# EAGLE design Preamp (EAGLE 9.2.2)
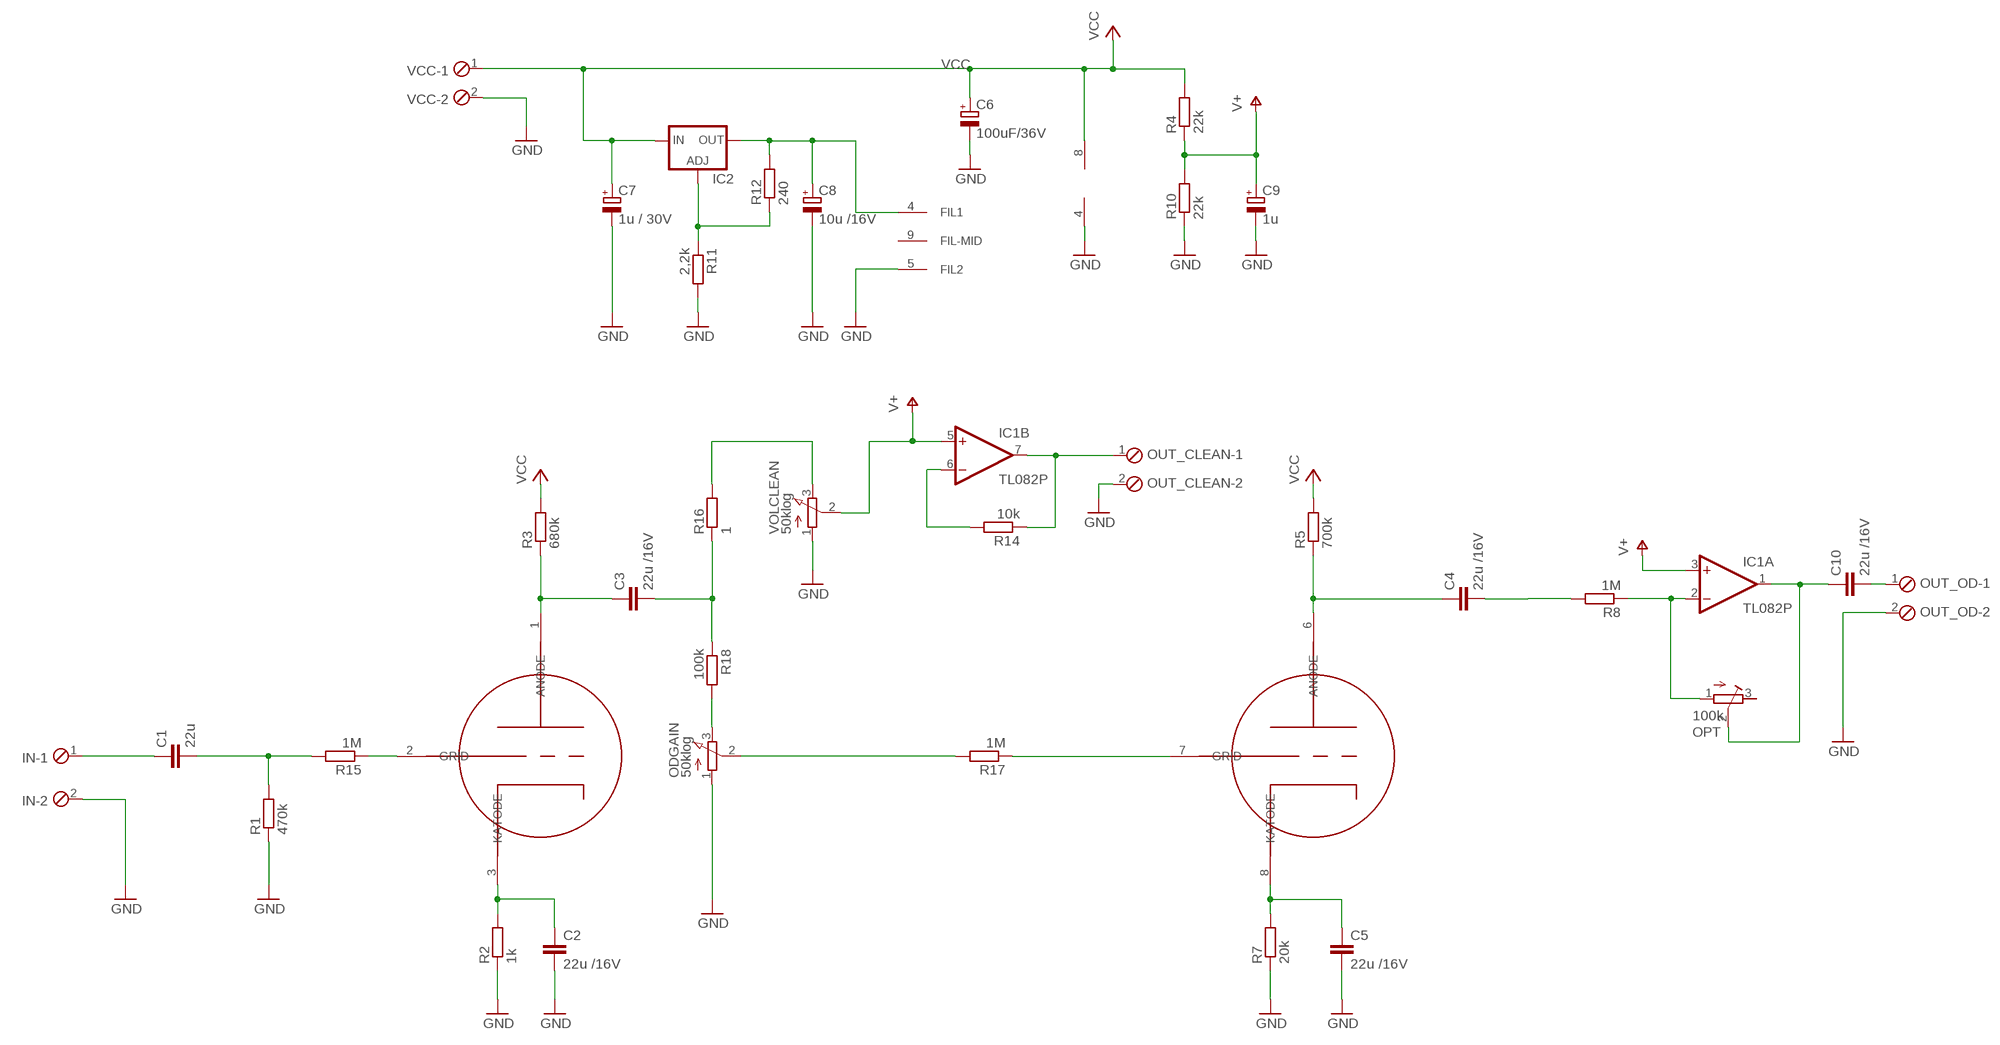
[diagram p0: schematic, sheet 1]

## Parts
C1  22u  C-EU050-030X075  [C050-030X075]
C2  22u /16V  C-EU050-030X075  [C050-030X075]
C3  22u /16V  C-EU050-030X075  [C050-030X075]
C4  22u /16V  C-EU050-030X075  [C050-030X075]
C5  22u /16V  C-EU050-030X075  [C050-030X075]
C6  100uF/36V  CPOL-EUE2.5-5  [E2,5-5]
C7  1u / 30V  CPOL-EUE2.5-5  [E2,5-5]
C8  10u /16V  CPOL-EUE2.5-5  [E2,5-5]
C9  1u  CPOL-EUE2.5-5  [E2,5-5]
C10  22u /16V  C-EU050-030X075  [C050-030X075]
IC1  TL082P  [DIL08]
IC2  LM317TS  [317TS]
IN  MPT2  [2POL254]
ODGAIN  50klog  3RP/1610N  [3RP/1610N]
OPT  100k  R-TRIMM74W  [RTRIM74W]
OUT_CLEAN  MPT2  [2POL254]
OUT_OD  MPT2  [2POL254]
R1  470k  R-EU_0207/12  [0207/12]
R2  1k  R-EU_0207/12  [0207/12]
R3  680k  R-EU_0207/12  [0207/12]
R4  22k  R-EU_0207/12  [0207/12]
R5  700k  R-EU_0207/12  [0207/12]
R7  20k  R-EU_0207/10  [0207/10]
R8  1M  R-EU_0207/12  [0207/12]
R10  22k  R-EU_0207/12  [0207/12]
R11  2,2k  R-EU_0207/12  [0207/12]
R12  240  R-EU_0207/12  [0207/12]
R14  10k  R-EU_0204/7  [0204/7]
R15  1M  R-EU_0207/12  [0207/12]
R16  1  R-EU_0207/12  [0207/12]
R17  1M  R-EU_0207/12  [0207/12]
R18  100k  R-EU_0207/12  [0207/12]
U$1  12AX7  [12AX7]
VCC  MPT2  [2POL254]
VOLCLEAN  50klog  3RP/1610N  [3RP/1610N]

## Nets
GND: C2.2 C5.2 C6.- C7.- C8.- C9.- IC1.4(P:V-) IN.2 ODGAIN.1(A) OUT_CLEAN.2 OUT_OD.2 R1.1 R2.1 R7.1 R10.1 R11.2 U$1.5(FIL2) VCC.2 VOLCLEAN.1(A)
N$1: C1.2 R1.2 R15.2
N$2: C2.1 R2.2 U$1.3(KATODE)
N$3: C5.1 R7.2 U$1.8(KATODE)
N$5: C3.1 R3.1 U$1.1(ANODE)
N$6: C3.2 R16.1 R18.1
N$7: C4.1 R5.1 U$1.6(ANODE)
N$8: C4.2 R8.2
N$9: C1.1 IN.1
N$10: IC1.2(A:-IN) OPT.1(A) R8.1
N$11: ODGAIN.2(S) R17.2
N$12: C10.1 IC1.1(A:OUT) OPT.2(S)
N$13: IC1.7(B:OUT) OUT_CLEAN.1 R14.1
N$14: C8.+ IC2.2(OUT) R12.2 U$1.4(FIL1)
N$15: R15.1 U$1.2(GRID)
N$16: IC2.1(ADJ) R11.1 R12.1
N$17: IC1.6(B:-IN) R14.2
N$18: R17.1 U$1.7(GRID)
N$19: R16.2 VOLCLEAN.3(E)
N$20: ODGAIN.3(E) R18.2
N$21: C10.2 OUT_OD.1
V+: C9.+ IC1.3(A:+IN) IC1.5(B:+IN) R4.1 R10.2 VOLCLEAN.2(S)
VCC: C6.+ C7.+ IC1.8(P:V+) IC2.3(IN) R3.2 R4.2 R5.2 VCC.1
Unconnected: OPT.3(E) U$1.9(FIL-MID)

## Library data of the parts
C1-C5 C10 = rcl:C-EU: CAPACITOR, European symbol; SPICEPREFIX: C
C6-C9 = rcl:CPOL-EU: POLARIZED CAPACITOR, European symbol; SPICEPREFIX: C
IC1 = linear:TL082: OP AMP Data sheet <http://www.ti.com/lit/ds/symlink/tl084a . pdf>; DATA_SHEET: <a href="http://www.ti.com/lit/ds/symlink/tl084a.pdf"> Data sheet </a>
IC2 = v-reg:LM317TS: VOLTAGE REGULATOR
IN OUT_CLEAN OUT_OD VCC = con-phoenix-254:MPT2: PHOENIX CONNECTOR; OC_FARNELL: unknown; OC_NEWARK: unknown
ODGAIN VOLCLEAN = pot:3RP/1610N: 16mm Potentiometer one level Source: http://www.alphapotentiometers.net/html/16mm_pot_2.html
OPT = rcl:R-TRIMM: Trimm resistor; SPICEMODEL: X; SPICEPREFIXL: POT
R1-R5 R7 R8 R10-R12 R14-R18 = rcl:R-EU_: RESISTOR, European symbol; SPICEPREFIX: R
U$1 = 12ax7:12AX7

## Board
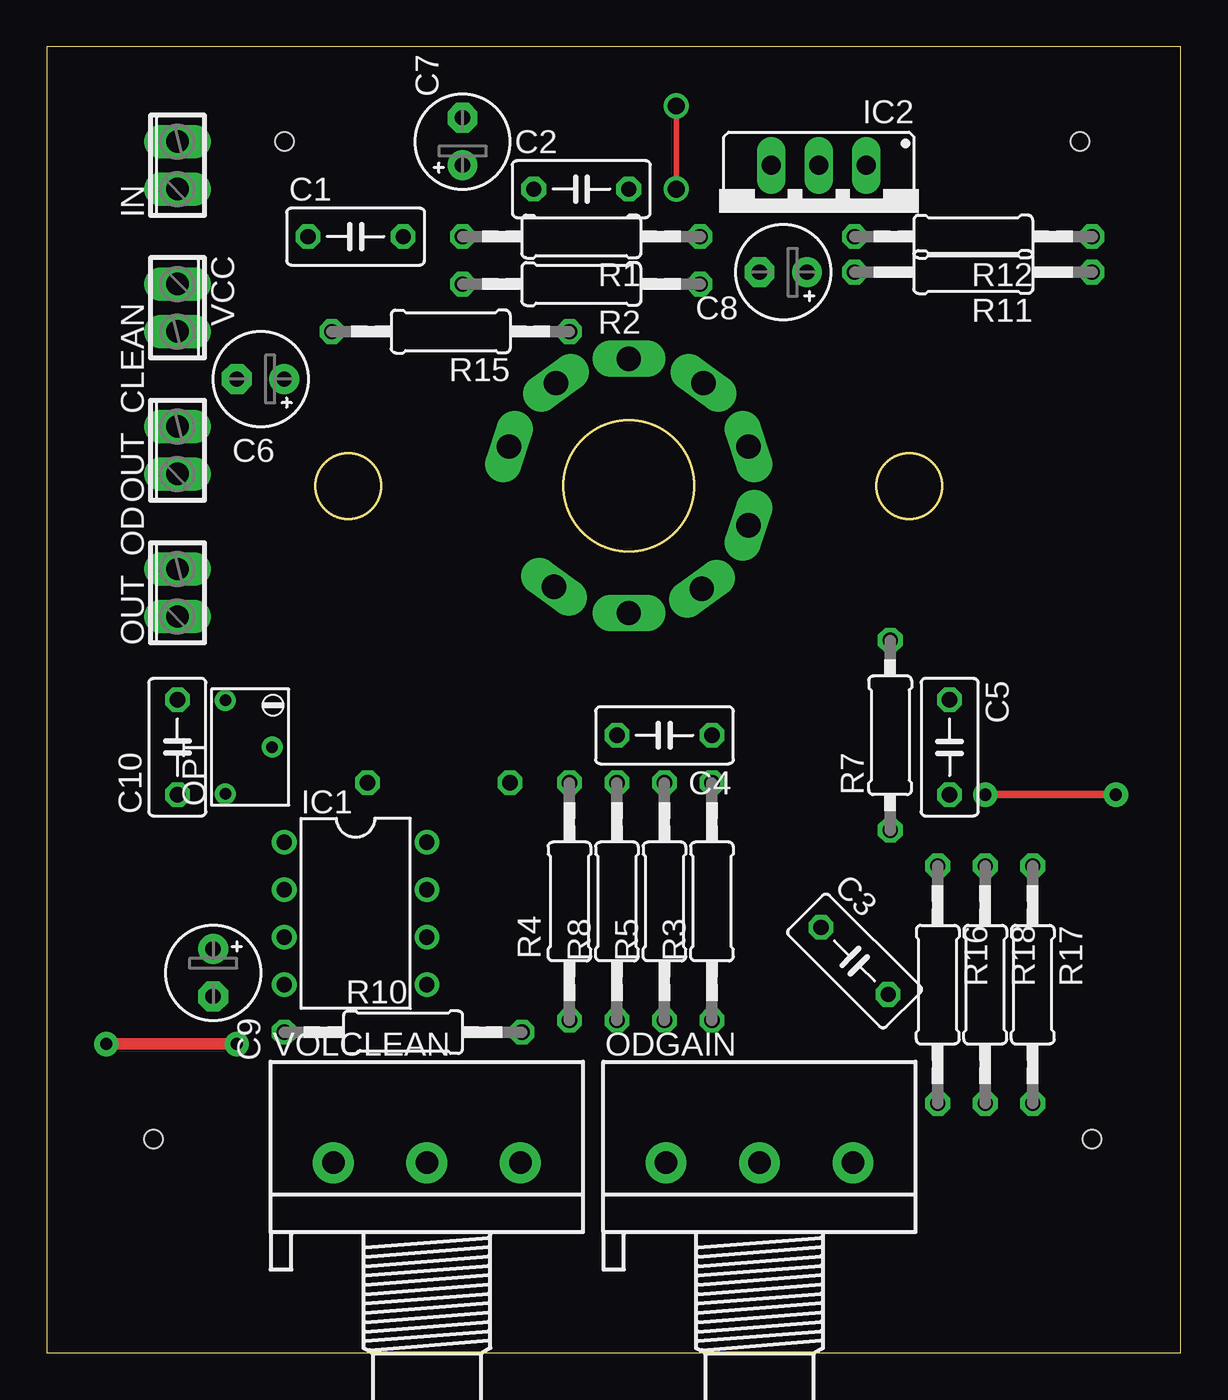
[diagram p1: board, top side]
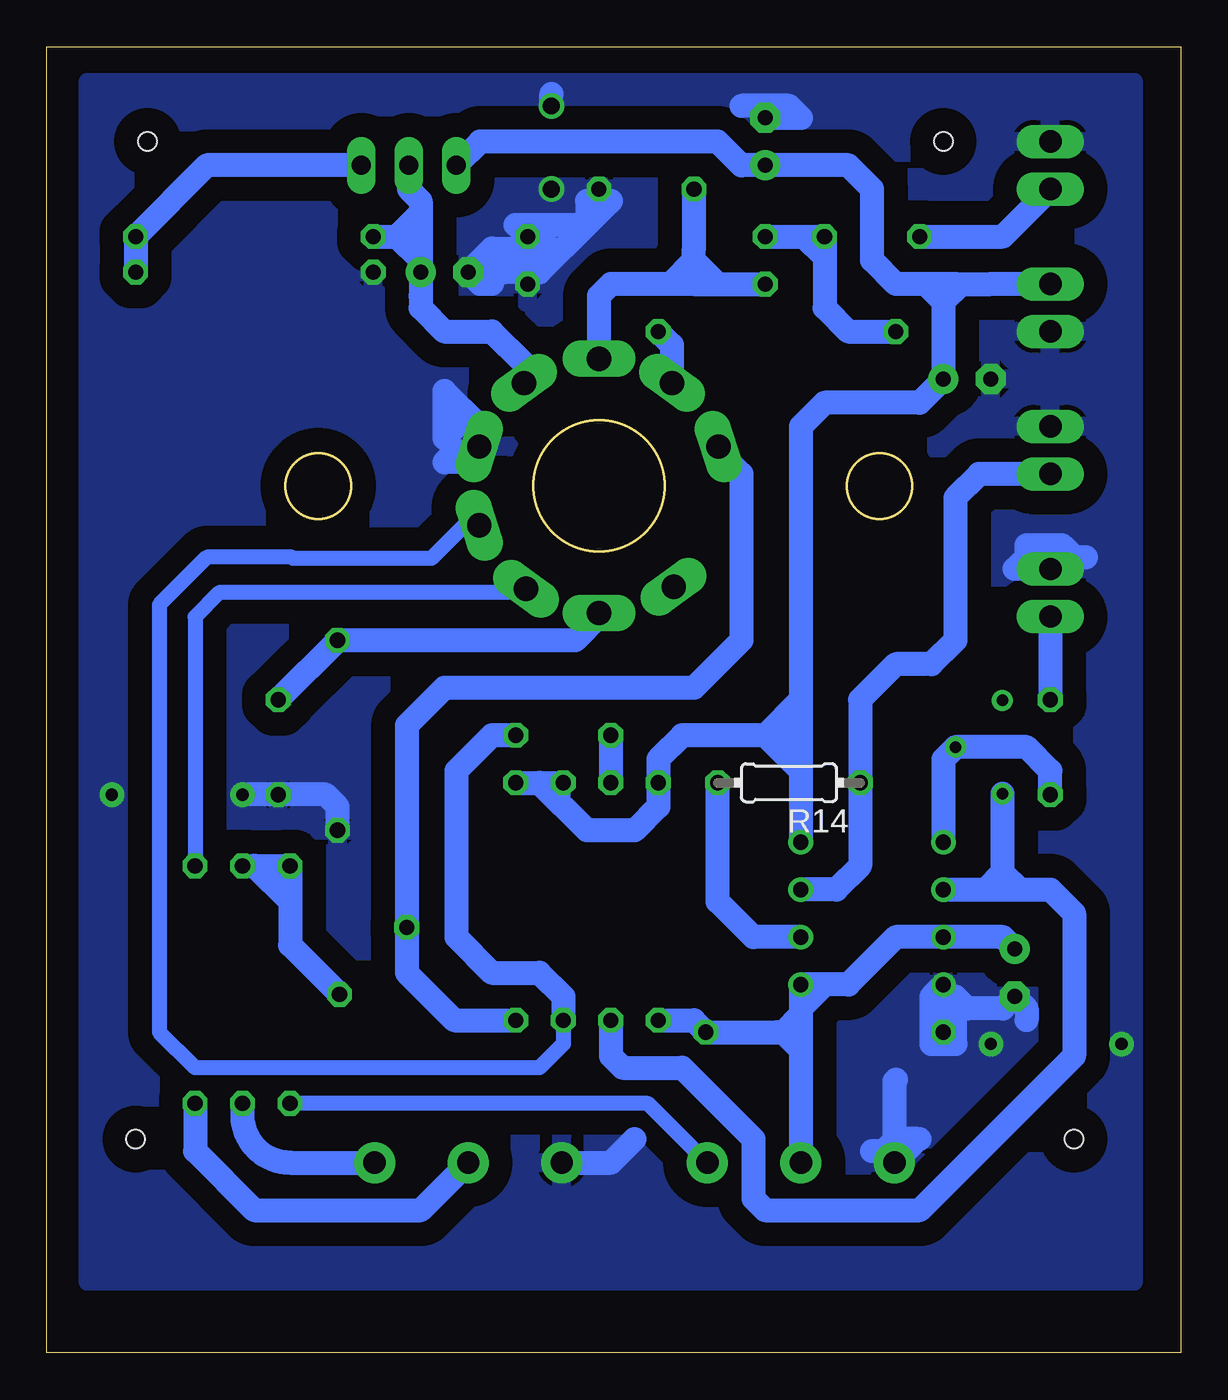
[diagram p2: board, bottom side, seen from below]

Size 60.63 x 69.84 mm. Coordinates in mm from the lower left corner, seen from the top.
Outline: 0,0 60.63,0 60.63,69.84 0,69.84 0,0
Copper layers (1*16): Top 0.035mm / dielectric 1.5mm / Bottom 0.035mm
Design rules "default": minimum track width 6mil, minimum drill 0.35mm, track to track 6mil, track to pad 6mil, pad to pad 6mil, via to via 6mil, smd to smd 6mil, copper to edge 40mil, drill to drill 6mil, minimum pad ring 10mil, minimum via ring 8mil, stop-mask expansion 4mil, vias tented up to drill 0mil, thermal gap 10mil
Holes 1 mm at 5.71,11.43 55.88,11.43 55.24,64.77 12.7,64.77

### Footprints (pad centres in the part's own frame; a part is rotated, then mirrored left to right if it is on the bottom)
C050-030X075 = drill 0.813 octagon: 1 -2.54,0; 2 2.54,0
E2,5-5 = drill 0.813 pad 1.6: + -1.27,0 | drill 0.813 pad 1.6 octagon: - 1.27,0
DIL08 = drill 0.813 pad 1.27: 1 -3.81,-3.81; 2 -1.27,-3.81; 3 1.27,-3.81; 4 3.81,-3.81; 5 3.81,3.81; 6 1.27,3.81; 7 -1.27,3.81; 8 -3.81,3.81
317TS = drill 1.016 long: 1 -2.54,-2.54; 2 0,-2.54; 3 2.54,-2.54
2POL254 = drill 1.2 long: 1 -1.27,0; 2 1.27,0
3RP/1610N = drill 1.2 pad 2.184: 1 -5,0; 2 0,0; 3 5,0
RTRIM74W = drill 0.61: 1 -1.25,-2.5; 2 1.25,0; 3 -1.25,2.5
0207/12 = drill 0.813 octagon: 1 -6.35,0; 2 6.35,0
0207/10 = drill 0.813 octagon: 1 -5.08,0; 2 5.08,0
0204/7 = drill 0.813 octagon: 1 -3.81,0; 2 3.81,0
12AX7 = drill 1.3 long: 1 -6.4,2.1; 2 -3.9,5.5; 3 0,6.8; 4 4,5.5; 5 6.4,2.1; 6 6.4,-2.1; 7 3.9,-5.5; 8 0,-6.8; 9 -4,-5.4

### Placement (x,y rotation side)
C1  16.51,59.69 0 top
C2  28.57,62.23 0 top
C3  43.18,20.95 315 top
C4  33.02,33.02 180 top
C5  48.26,32.38 270 top
C6  11.43,52.07 180 top
C7  22.23,64.77 90 top
C8  39.37,57.78 180 top
C9  8.89,20.32 270 top
C10  6.98,32.38 90 top
IC1  16.51,23.49 270 top
IC2  41.27,60.96 180 top
IN  6.98,63.5 90 top
ODGAIN  38.1,10.16 0 top
OPT  10.79,32.38 0 top
OUT_CLEAN  6.98,48.26 90 top
OUT_OD  6.98,40.64 90 top
R1  28.57,59.69 180 top
R2  28.57,57.15 180 top
R3  35.56,24.13 90 top
R4  27.94,24.13 90 top
R5  33.02,24.13 90 top
R7  45.09,33.02 90 top
R8  30.48,24.13 90 top
R10  19.05,17.14 0 top
R11  49.53,57.78 180 top
R12  49.53,59.69 180 top
R14  20.95,30.48 180 bottom
R15  21.59,54.61 180 top
R16  47.62,19.69 270 top
R17  52.7,19.69 270 top
R18  50.16,19.69 270 top
U$1  31.11,46.35 0 top
VCC  6.98,55.88 270 top
VOLCLEAN  20.32,10.16 0 top

### Tracks (layer width: path | path; a pad name or v marks a point on that pad's centre or on a via)
GND  (via drill 0.65 pad 1.3, 0.9, 0.9 pad 1.3)
  Top 0.305: v33.65,66.67 v33.65,62.23
  Top 0.406: v50.16,29.84 v57.15,29.84
  Top 0.61: v3.17,16.51 v10.16,16.51
  Bottom 1.27: v33.65,66.67 33.65,67.31 | ODGAIN.1 30.48,10.16 29.21,11.43 | 15.24,14.61 15.32,14.53 VOLCLEAN.1 | R7.1 45.09,29.21 45.72,29.84 C5.2 v50.16,29.84 | 38.73,49.53 39.37,48.89 39.37,51.43 37.52,49.58 U$1.5 38.34,47.62 39.37,47.62 38.73,48.26 | 33.65,59.05 36.83,59.05 C8.- 37.46,57.15 36.83,57.15 36.83,58.42 36.2,57.78 34.29,57.78 31.75,60.32 | R1.1 35.56,60.32 31.75,60.32 | 31.75,60.32 30.48,61.59 31.75,61.59 31.75,60.32 | C7.- 20.32,66.04 20.95,66.67 23.49,66.67 | 5.71,42.55 6.35,43.18 8.26,43.18 8.26,42.55 8.89,41.91 OUT_OD.2 6.35,42.55 5.71,42.55 | 5.71,42.55 5.08,42.55 | IC1.4 13.33,19.05 13.33,16.51 12.06,16.51 12.06,19.05 11.43,18.41 9.53,18.41 C9.- 8.26,18.41 8.26,17.78 | VOLCLEAN.1 14.05,11.43 | 14.05,11.43 13.97,11.43 | 14.05,11.43 15.24,11.43 15.87,10.79 15.96,10.79 | 16.51,10.79 15.96,10.79 | 15.96,10.79 VOLCLEAN.1
  pour Bottom (isolate 1.27): 2.54,67.95 2.54,3.81 58.42,3.81 58.42,67.95
N$1
  Bottom 1.016: R1.2 20.32,59.69 | 20.32,59.69 C1.2 19.05,58.42 | 20.32,59.69 19.05,58.42 | 19.05,58.42 19.05,55.88
  Bottom 1.27: R1.2 C1.2 19.05,55.88 17.78,54.61 R15.2
N$2
  Bottom 1.016: 26.03,59.05 26.03,58.42 26.03,57.78 | 26.03,57.15 27.3,57.15
  Bottom 1.27: C2.1 26.03,59.05 26.03,57.78 26.03,57.15 | 26.03,57.15 24.77,57.15 | 24.77,57.15 R2.2 | 26.03,57.15 30.48,57.15 31.11,56.52 U$1.3 | 24.77,57.15 26.03,58.42 27.3,57.15
N$3
  Bottom 1.27: U$1.8 31.11,39.37 32.38,38.1 R7.2 C5.1
N$5
  Bottom 1.27: U$1.1 24.71,48.21 23.49,46.99 23.49,38.1 26.03,35.56 39.37,35.56 41.38,33.55 C3.1 41.38,20.32 38.84,17.78 R3.1
N$6
  Bottom 1.27: R18.1 49.53,26.03 | 49.53,26.03 R16.1 47.62,24.13 | 47.62,24.13 47.62,21.81 C3.2 | 47.62,24.13 49.53,26.03
N$7
  Bottom 0.813: 33.02,18.41 R5.1 33.02,16.51 34.29,15.24 52.7,15.24 54.61,17.14 54.61,40 52.07,42.55 47.52,42.55 47.45,42.48 40.07,42.48 38.29,44.25 U$1.6
  Bottom 1.27: C4.1 36.83,33.02 38.73,31.12 38.73,22.23 36.83,20.32 34.29,20.32 33.02,19.05 R5.1
N$8
  Bottom 1.27: C4.2 R8.2
N$9
  Bottom 1.27: C1.1 9.53,59.69 IN.1
N$10
  Bottom 0.813: 9.51,29.84 OPT.1 9.54,26.03 | 9.54,26.03 9.54,25.4 9.54,24.77 | 6.98,24.77 8.28,24.77 | 8.28,24.77 9.54,24.77 | IC1.2 10.79,24.77 | 10.79,24.77 9.54,24.77 | 9.54,26.03 8.28,24.77 | 9.54,26.03 10.79,24.78 10.79,24.77
  Bottom 1.27: OPT.1 9.54,25.4 | IC1.2 6.98,24.77 5.71,23.49 5.71,15.88 13.97,7.62 22.23,7.62 22.86,8.25 22.86,11.43 26.67,15.24 29.84,15.24 30.48,15.88 R8.1
N$11
  Bottom 1.27: R17.2 52.7,10.79 49.53,7.62 40.64,7.62 ODGAIN.2
N$12
  Bottom 1.27: C10.1 6.98,31.12 8.26,32.38 OPT.2 12.7,31.73 IC1.1
N$13
  Bottom 1.27: OUT_CLEAN.1 10.79,46.99 12.06,45.72 12.06,38.1 13.33,36.83 15.24,36.83 17.14,34.92 R14.1 17.14,26.03 18.41,24.77 IC1.7
N$14
  Bottom 0.813: 40.64,58.42 C8.+ 40.64,56.52
  Bottom 1.27: IC2.2 41.27,62.23 40.64,61.59 40.64,60.96 | 40.64,58.42 40.64,56.52 40.64,55.88 39.37,54.61 36.83,54.61 35.11,52.89 U$1.4 | 40.64,60.96 40.64,58.42 | R12.2 41.91,59.69 | 41.91,59.69 40.64,60.96 | 41.91,59.69 40.64,58.42
N$15
  Bottom 1.27: R15.1 27.21,53.88 U$1.2
N$16
  Bottom 1.27: IC2.1 52.07,63.5 R12.1 R11.1
N$17
  Bottom 1.27: IC1.6 22.86,22.23 24.77,24.13 R14.2
N$18
  Bottom 0.813: U$1.7 35.23,40.64 51.43,40.64 52.7,39.37 R17.1
N$19
  Bottom 0.813: VOLCLEAN.3 28.49,13.34 R16.2
N$20
  Bottom 1.27: ODGAIN.3 47.62,10.16 arc90 50.16,12.7 R18.2
N$21
  Bottom 1.27: OUT_OD.1 C10.2
V+
  Bottom 0.813: 20.32,18.41 21.59,17.14 20.32,15.88
  Bottom 1.27: C9.+ 9.53,22.23 IC1.3 15.24,22.23 17.78,19.69 19.05,19.69 | 19.05,19.69 IC1.5 20.32,18.41 | 20.32,18.41 20.32,17.14 | 20.32,17.14 20.32,15.88 VOLCLEAN.2 | 19.05,19.69 20.32,18.41 | 20.32,17.14 21.59,17.14 R10.2 26.03,17.78 R4.1
VCC
  Bottom 0.813: 10.16,57.15 11.43,57.15 | 11.43,57.15 12.06,57.15 12.7,57.15 | 12.7,57.15 13.33,57.15 13.97,57.15 | 13.97,57.15 15.24,57.15 | 12.7,54.61 12.7,55.88 | 12.7,55.88 11.43,57.15 | 12.7,55.88 13.97,57.15 | 12.7,55.88 12.7,56.52 12.7,57.15 | 33.02,29.21 31.75,27.94 | 33.02,29.21 R5.2 34.29,30.48 | R3.2 34.29,30.48 | 20.32,31.12 20.32,33.02 20.32,33.66 | 33.02,29.21 34.29,30.48
  Bottom 1.27: VCC.1 10.16,57.15 12.06,57.15 13.33,57.15 15.24,57.15 16.51,58.42 16.51,62.23 17.78,63.5 C7.+ 23.49,63.5 24.77,64.77 37.46,64.77 IC2.3 | 12.7,56.52 12.7,54.61 C6.+ 13.97,50.8 19.05,50.8 20.32,49.53 20.32,34.92 | 20.32,34.92 20.32,33.66 20.32,31.12 | 20.32,31.12 IC1.8 | 20.32,33.02 22.23,33.02 | 22.23,33.02 26.67,33.02 27.94,31.75 R4.2 27.94,29.21 29.21,27.94 31.75,27.94 34.29,30.48 | R3.2 R5.2 | 22.23,33.02 20.32,34.92 | 22.23,33.02 20.32,31.12